# Altium schematic sheet SD_Board.SchDoc
size 292 x 205 mm
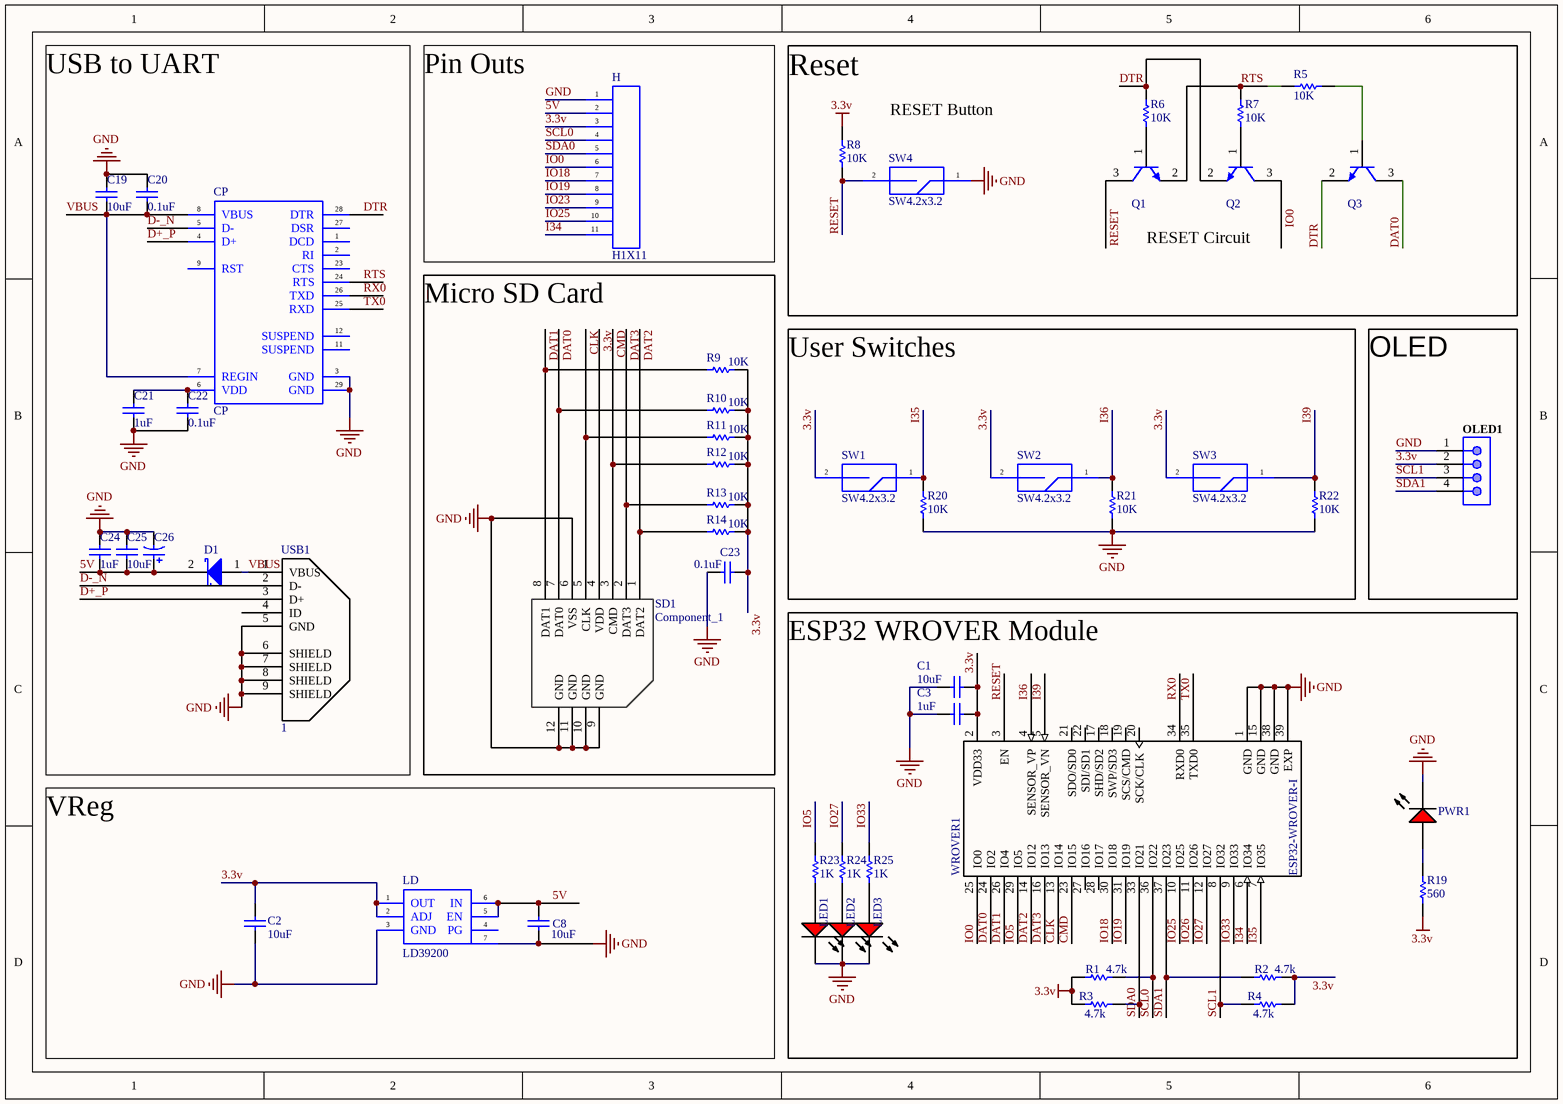
[diagram p0: SD_Board.SchDoc]

## Parts
C1  10uF  [CAPC0402(1005)60_M]
C2  10uF  [CAPC1608X90X35NL15T15]
C3  1uF  [CAPC0402(1005)60_M]
C8  10uF  [CAPC1608X90X35NL15T15]
C19  10uF  [CAPC0402(1005)60_M]
C20  0.1uF  [CAPC0402(1005)60_M]
C21  1uF  [CAPC0402(1005)60_M]
C22  0.1uF  [CAPC0402(1005)60_M]
C23  0.1uF  [CAPC0402(1005)60_M]
C24  1uF  [CAPC0402(1005)60_M]
C25  10uF  [CAPC0402(1005)60_M]
C26  T491B105K025AT  [KEMT-T491-B_L]  (value not drawn)
CP  CP  [PCBComponent_1]
D1  1N5819HW-7-F  [DIOD-SOD-123-2_V]  (value not drawn)
H  H1X11  [PCBComponent_1]
LD  LD39200  [PCBComponent_1]
LED1  grn  [VISH-TLMX1100_V]  (value not drawn)
LED2  grn  [VISH-TLMX1100_V]  (value not drawn)
LED3  grn  [VISH-TLMX1100_V]  (value not drawn)
OLED1  PH2541-4-SPGRH-6-3  [PCE-PH2541-4-SPGRH-6-3_V]  (value not drawn)
PWR1  grn  [VISH-TLMX1100_V]  (value not drawn)
Q1  MMBT2222AWT1G  [ONSC-SC-70-3-419-04_V]  (value not drawn)
Q2  MMBT2222AWT1G  [ONSC-SC-70-3-419-04_V]  (value not drawn)
Q3  MMBT2222AWT1G  [ONSC-SC-70-3-419-04_V]  (value not drawn)
R1  4.7k  [RESC1608X55X30LL15T15]
R2  4.7k  [RESC1608X55X30LL15T15]
R3  4.7k  [RESC1608X55X30LL15T15]
R4  4.7k  [RESC1608X55X30LL15T15]
R5  10K  [RESC0402(1005)_M]
R6  10K  [RESC0402(1005)_M]
R7  10K  [RESC0402(1005)_M]
R8  10K  [RESC0402(1005)_M]
R9  10K  [RESC0402(1005)_M]
R10  10K  [RESC0402(1005)_M]
R11  10K  [RESC0402(1005)_M]
R12  10K  [RESC0402(1005)_M]
R13  10K  [RESC0402(1005)_M]
R14  10K  [RESC0402(1005)_M]
R19  560  [RESC0402(1005)_M]
R20  10K  [RESC0402(1005)_M]
R21  10K  [RESC0402(1005)_M]
R22  10K  [RESC0402(1005)_M]
R23  1K  [RESC0402(1005)_M]
R24  1K  [RESC0402(1005)_M]
R25  1K  [RESC0402(1005)_M]
SD1  Component_1  [SD_Amphenol]
SW1  SW4.2x3.2  [Switch4.2x3.2]
SW2  SW4.2x3.2  [Switch4.2x3.2]
SW3  SW4.2x3.2  [Switch4.2x3.2]
SW4  SW4.2x3.2  [Switch4.2x3.2]
USB1  1  [PCBComponent_1]
WROVER1  ESP32-WROVER-I  [XCVR_ESP32-WROVER-I]

## Nets
3.3v: C1.1 C2.2 C3.1 C23.1 H.3 LD.1(OUT) LD.2(ADJ) OLED1.2 R1.2 R2.2 R3.2 R4.2 R8.1 R9.2 R10.2 R11.2 R12.2 R13.2 R14.2 R19.1 SD1.4(VDD) SW1.2 SW2.2 SW3.2 WROVER1.2(VDD33)
GND: C1.2 C2.1 C3.2 C8.2 C19.2 C20.2 C21.1 C22.1 C23.2 C24.2 C25.2 C26.2 CP.3(GND) CP.29(GND) H.1 LD.3(GND) LD.7(PAD) LED1.2(K) LED2.2(K) LED3.2(K) OLED1.1 PWR1.2(K) R20.1 R21.1 R22.1 SD1.6(VSS) SD1.9(GND) SD1.10(GND) SD1.11(GND) SD1.12(GND) SW4.1 USB1.5(GND) USB1.6(SHIELD) USB1.7(SHIELD) USB1.8(SHIELD) USB1.9(SHIELD) WROVER1.1(GND) WROVER1.15(GND) WROVER1.38(GND) WROVER1.39(EXP)
5V: C8.1 C24.1 C25.1 C26.1 D1.2(K) H.2 LD.5(EN) LD.6(IN)
CLK: R11.1 SD1.5(CLK) WROVER1.13(IO14)
CMD: R12.1 SD1.3(CMD) WROVER1.23(IO15)
D+_P: CP.4(D+) USB1.3(D+)
D-_N: CP.5(D-) USB1.2(D-)
DAT0: Q3.3(C) R10.1 SD1.7(DAT0) WROVER1.24(IO2)
DAT1: R9.1 SD1.8(DAT1) WROVER1.26(IO4)
DAT2: R14.1 SD1.1(DAT2) WROVER1.14(IO12)
DAT3: R13.1 SD1.2(DAT3) WROVER1.16(IO13)
DTR: CP.28(DTR) Q2.2(E) Q3.2(E) R6.2
I34: H.11 WROVER1.6(IO34)
I35: R20.2 SW1.1 WROVER1.7(IO35)
I36: R21.2 SW2.1 WROVER1.4(SENSOR_VP)
I39: R22.2 SW3.1 WROVER1.5(SENSOR_VN)
IO0: H.6 Q2.3(C) WROVER1.25(IO0)
IO5: R23.1 WROVER1.29(IO5)
IO18: H.7 WROVER1.30(IO18)
IO19: H.8 WROVER1.31(IO19)
IO23: H.9
IO25: H.10 WROVER1.10(IO25)
IO26: WROVER1.11(IO26)
IO27: R24.1 WROVER1.12(IO27)
IO33: R25.1 WROVER1.9(IO33)
RESET: Q1.3(C) R8.2 SW4.2 WROVER1.3(EN)
RTS: CP.24(RTS) Q1.2(E) R5.2 R7.2
RX0: CP.26(TXD) WROVER1.34(RXD0)
SCL0: H.4 R1.1 WROVER1.36(IO22)
SCL1: OLED1.3 R4.1 WROVER1.8(IO32)
SDA0: H.5 R3.1 WROVER1.33(IO21)
SDA1: OLED1.4 R2.1 WROVER1.37(IO23)
TX0: CP.25(RXD) WROVER1.35(TXD0)
VBUS: C19.1 C20.1 CP.7(REGIN) CP.8(VBUS) D1.1(A) USB1.1(VBUS)
NetC21_2: C21.2 C22.2 CP.6(VDD)
NetLED1_1: LED1.1(A) R23.2
NetLED2_1: LED2.1(A) R24.2
NetLED3_1: LED3.1(A) R25.2
NetPWR1_1: PWR1.1(A) R19.2
NetQ1_1: Q1.1(B) R6.1
NetQ2_1: Q2.1(B) R7.1
NetQ3_1: Q3.1(B) R5.1

Not connected (* = marked no-connect by the designer): CP 1(DCD) 2(RI) 9(RST) 11(SUSPEND) 12(SUSPEND) 23(CTS) 27(DSR); LD 4(PG); USB1 4(ID); WROVER1 17(SHD/SD2) 18(SWP/SD3) 19(SCS/CMD) 20(SCK/CLK) 21(SDO/SD0) 22(SDI/SD1) 27(IO16) 28(IO17)

## Notes on the sheet
- RESET Button
- RESET Circuit
- (near H) Pin Outs
- Reset
- User Switches
- (near OLED1) OLED
- USB to UART
- Micro SD Card
- VReg
- ESP32 WROVER Module

## Library data of the parts
C1 C3 C19 C21 C24 C25 = CMP-1034-00526-1: CAP 10uF 6.3V ±0.5pF 0402 (1005 Metric) Thickness 0.6mm SMD; Tolerance: Â±0.5pF; Value: 6.9pF; Case-Metric: 1005; Rated Voltage: 50 V; Case-EIA: 0402; Max Thickness: 0.6 mm; Technology: SMT
C2 C8 = CMP-2006-04419-1: Manufacturer: AVX Interconnect / Elco; Part Number: 06035C271JAT2A
C20 C22 C23 = CMP-1034-00526-1: CAP .1uF 6.3V ±0.5pF 0402 (1005 Metric) Thickness 0.6mm SMD; Tolerance: Â±0.5pF; Value: 6.9pF; Case-Metric: 1005; Rated Voltage: 50 V; Case-EIA: 0402; Max Thickness: 0.6 mm; Technology: SMT
C26 = CMP-2000-07190-1: Tantalum Capacitor, 1 uF, +/- 10%, 25 V, -55 to 125 degC, 1411 (3528 Metric), RoHS, Tape and Reel; Manufacturer: Kemet; Wire Form: NotRequired; DF: 4%; Product Diameter (mm): NotRequiredmm; Product Depth (mm): 2.8mm; Voltage: 25VDC; DCL: 0.5uA; Capacitance: 1uF; Product Height (mm): 1.9mm; ESR: 5ohm; Product Length (mm): 3.5mm; Polarity: Polar; Case Style: Molded; Package / Case: 3528-21; Failure Rate: NotRequired; Datasheet Version: 10/2016; Seal: NotRequired; Package Reference: T491-B; Insulation: NotRequired; Tolerance (+ or -): 10%; Length W/Weld: NotRequiredmm; Lead Spacing (nom): NotRequiredmm; Packaging: TapeandReel; Operating Temp Range: -55Cto125C; Case Code: B; Mounting Technology: SurfaceMount; Datasheet URL: http://capacitoredge.kemet.com/capedge2/DataSheet/Datasheet-T491B105K025AT.pdf?pn=T491B105K025AT; Construction: SMTChip; Seated Plane Height: NotRequiredmm; Manufacturer URL: http://www.kemet.com/; Mounting Style: SurfaceMount; Package Description: 2-Pin Surface Mount Device, Body 3.5 x 2.8 mm
D1 = CMP-0303-00003-1: 1.0 A Surface Mount Schottky Barrier Rectifier, 40 V, -65 to 125 degC, 2-Pin SOD-123 Package, RoHS, Tape and Reel; Manufacturer: Diodes Inc; @ VR (V): 40; @ Terminal Temperature TT (degC): 90; Maximum Average Rectified Current IO (A): 1; Total Capacitance CT (pF): 50; Peak Forward Surge Current IFSM (A): 25; Forward Voltage Drop VF (V): 0.45; VR (RMS) (V): 28; RoHS: TRUE; PartNumber: 1N5819HW-7-F; ComponentLink2URL: http://www.diodes.com/datasheets/ds30217.pdf; PackageDescription: 2-Pin SOD-123, Body 2.7 x 1.55 mm, Pitch 3.7 mm; @ IF (A): 1; Operating and Storage Temperature Range: -65 to 125 degC; ComponentLink1Description: Manufacturer URL; ComponentLink2Description: Datasheet; ComponentLink1URL: http://www.diodes.com/; Mounting Technology: Surface Mount; DatasheetVersion: Rev. 15-2; PackageReference: SOD-123-2; Maximum Reverse Current IR (uA): 50; Peak Repetitive Reverse Voltage VRRM (V): 40; Packing: Tape and Reel
LED1-LED3 PWR1 = CMP-1666-00027-1: LED, RED, 2.1 V, -40 to 100 degC, 2-Pin SMD (0603), RoHS, Tape and Reel; Type (Capacitors): C0G; Resistance: 100000000000 Ohm; Capacitance: 12 pF; Voltage Rating: 50 V; Tolerance: 5%; Min Operating Temperature: -55degC; REACH SVHC: No SVHC; ComponentLink2Description: Datasheet; ComponentLink1URL: http://www.vishay.com/; Width: 0.8 mm; Package Quantity: 4000; PackageReference: TLMX1100; ComponentLink2URL: http://www.vishay.com/docs/83173/tlmb1100.pdf; Case/Package: 0603; Case Code (Metric): 1608; Packaging: Tape and Reel; Pins: 2; ComponentLink1Description: Manufacturer URL; Max Operating Temperature: 125degC; Height: 0.8 mm; Length: 1.6 mm; Mount: Surface Mount; PackageDescription: 2-Pin Surface Mount Device, Body 1.6 x 0.8 mm; DatasheetVersion: Rev. 2.7, 03/2016; Case Code (Imperial): 0603; Voltage Rating (DC): 50 V; RoHSCompliant: True; Radiation Hardening: No
OLED1 = CMP-0423-00005-2: Male Header, Pitch 2.54 mm, 1x4 Position, Mated Height 6 mm, Tail Length 3 mm; Manufacturer: Pinchao Electronic; Contact Meaterial: Brass; Insulator resistance (Min.): 1000 Megohms; No. of Rows: 1; Insulator Material: PBT; Current Rating: 3 Amps; Pitch: 2.54 mm; Dielectric Withstaanding: 600 AC/DC; No. of positions: 4; Contact Resistance (Max): 20 Megohms; Connector Type: Male Header; PackageDescription: Male Header, Pitch 2.54 mm, 1x4 Position, Mated Height 6 mm, Tail Length 3 mm; ComponentLink1URL: http://www.suzhoupinchao.com/; Mounting Technology: Through Hole; Operating Temperature: -40 to 105 degC; PartNumber: PH2541-4-SPGRH-6-3; PackageReference: PH2541-4-SPGRH-6-3; ComponentLink1Description: Manufacturer URL
Q1-Q3 = CMP-1048-00382-1: General Purpose Transistor, NPN Silicon, 3-Pin SC70, Pb-Free, Tape and Reel; Manufacturer: On Semiconductor; IC Continuous (A): 0.6; fT Min (MHz): 300; PartNumber: MMBT2222AWT1G; ComponentLink3URL: http://www.onsemi.cn/pub_link/Collateral/419-04.PDF; ComponentLink2URL: http://www.onsemi.cn/pub_link/Collateral/MMBT2222AWT1-D.PDF; DatasheetVersion: Rev. 6; ComponentLink1Description: Manufacturer URL; PackageReference: SC-70-3-419-04; Packing: Tape and Reel; Polarity: NPN; ComponentLink1URL: http://www.onsemi.com/; RoHS: TRUE; PackageVersion: Rev. N, 11/2008; Mounting Technology: Surface Mount; ComponentLink2Description: Datasheet; PackageDescription: 3-Pin Small Outline Transistor, Body 2 x 1.25 mm, Pitch 0.65 mm; ComponentLink3Description: Package Specification
R1-R4 = CMP-1665-00048-1: Chip Resistor, 22 Ohm, +/- 1%, 0.1 W, -55 to 155 degC, 0603 (1608 Metric), RoHS, Tape and Reel; PackageReference: 0603; ComponentLink2URL: http://industrial.panasonic.com/cdbs/www-data/pdf/RDA0000/AOA0000C86.pdf; ComponentLink2Description: Datasheet; PackageDescription: 2-Pin Surface Mount Device, Body 1.6 x 0.85 mm; ComponentLink1URL: http://www.panasonic.com/; ComponentLink1Description: Manufacturer URL; DatasheetVersion: Apr-15
R5-R14 R20-R25 = CMP-1011-00626-1: 10K 0.063W 1% 0402 (1005 Metric)  SMD; Case-EIA: 0402; Case-Metric: 1005; Value: 10700.00 Ohm; Technology: SMT; Tolerance: 1 %; Power: 0.063 W
R19 = CMP-1011-00433-1: 560R 0.063W 1% 0402 (1005 Metric)  SMD; Case-Metric: 1005; Value: 220.00 Ohm; Case-EIA: 0402; Technology: SMT; Tolerance: 1 %; Power: 0.063 W
USB1 = Component_1
WROVER1 = ESP32-WROVER-I: Module: combo; GPIO, I2C x2, I2S x2, SDIO, SPI x3, UART x3; U.FL; MF: Espressif Systems; Digi-Key_Part_Number: 1904-1008-1-ND; SnapEDA_Link: https://www.snapeda.com/parts/ESP32-WROVER-I/Espressif%20Systems/view-part/?ref=snap; MP: ESP32-WROVER-I; Digi-Key_Purchase_URL: https://www.digikey.com/product-detail/en/espressif-systems/ESP32-WROVER-I/1904-1008-1-ND/8544303?utm_source=snapeda&utm_medium=aggregator&utm_campaign=symbol; Package: Module Espressif Systems; Value: *